# Altium schematic sheet Sheet2.SchDoc
size A4; SheetNumber: 2; SheetTotal: 5
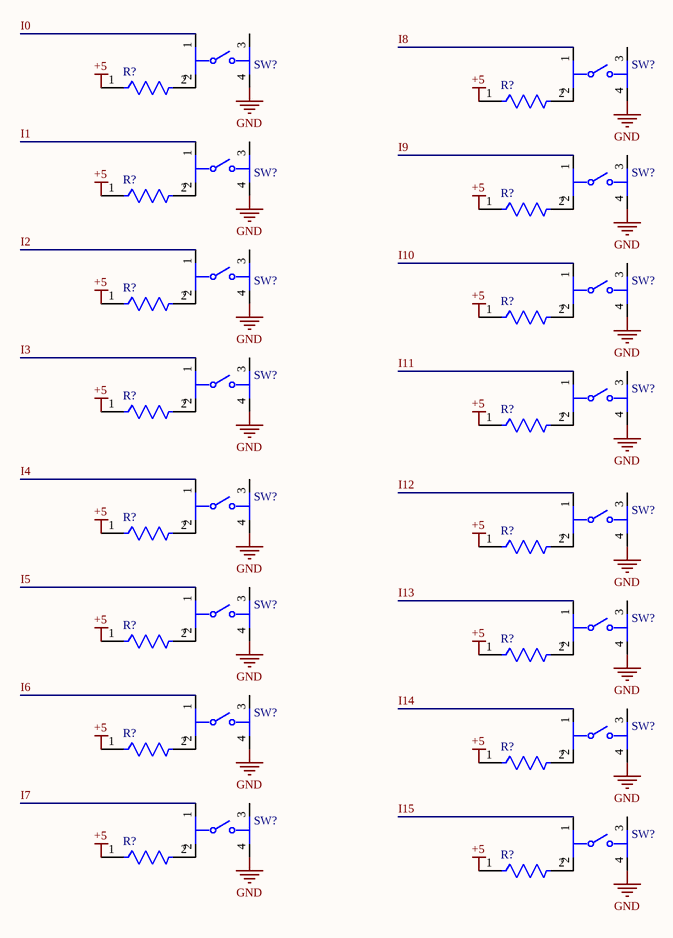
[diagram p0: Sheet2.SchDoc]

## Parts
(Parts that share a designator on the sheet are numbered #1, #2 ... from top to bottom, then left to right.)
R?#1  MRS25000C1001FCT00  [FP-MRS25-MFG]  (value not drawn)
R?#2  MRS25000C1001FCT00  [FP-MRS25-MFG]  (value not drawn)
R?#3  MRS25000C1001FCT00  [FP-MRS25-MFG]  (value not drawn)
R?#4  MRS25000C1001FCT00  [FP-MRS25-MFG]  (value not drawn)
R?#5  MRS25000C1001FCT00  [FP-MRS25-MFG]  (value not drawn)
R?#6  MRS25000C1001FCT00  [FP-MRS25-MFG]  (value not drawn)
R?#7  MRS25000C1001FCT00  [FP-MRS25-MFG]  (value not drawn)
R?#8  MRS25000C1001FCT00  [FP-MRS25-MFG]  (value not drawn)
R?#9  MRS25000C1001FCT00  [FP-MRS25-MFG]  (value not drawn)
R?#10  MRS25000C1001FCT00  [FP-MRS25-MFG]  (value not drawn)
R?#11  MRS25000C1001FCT00  [FP-MRS25-MFG]  (value not drawn)
R?#12  MRS25000C1001FCT00  [FP-MRS25-MFG]  (value not drawn)
R?#13  MRS25000C1001FCT00  [FP-MRS25-MFG]  (value not drawn)
R?#14  MRS25000C1001FCT00  [FP-MRS25-MFG]  (value not drawn)
R?#15  MRS25000C1001FCT00  [FP-MRS25-MFG]  (value not drawn)
R?#16  MRS25000C1001FCT00  [FP-MRS25-MFG]  (value not drawn)
SW?#1  1-1825910-5  [FP-1-1825910-5-MFG]  (value not drawn)
SW?#2  1-1825910-5  [FP-1-1825910-5-MFG]  (value not drawn)
SW?#3  1-1825910-5  [FP-1-1825910-5-MFG]  (value not drawn)
SW?#4  1-1825910-5  [FP-1-1825910-5-MFG]  (value not drawn)
SW?#5  1-1825910-5  [FP-1-1825910-5-MFG]  (value not drawn)
SW?#6  1-1825910-5  [FP-1-1825910-5-MFG]  (value not drawn)
SW?#7  1-1825910-5  [FP-1-1825910-5-MFG]  (value not drawn)
SW?#8  1-1825910-5  [FP-1-1825910-5-MFG]  (value not drawn)
SW?#9  1-1825910-5  [FP-1-1825910-5-MFG]  (value not drawn)
SW?#10  1-1825910-5  [FP-1-1825910-5-MFG]  (value not drawn)
SW?#11  1-1825910-5  [FP-1-1825910-5-MFG]  (value not drawn)
SW?#12  1-1825910-5  [FP-1-1825910-5-MFG]  (value not drawn)
SW?#13  1-1825910-5  [FP-1-1825910-5-MFG]  (value not drawn)
SW?#14  1-1825910-5  [FP-1-1825910-5-MFG]  (value not drawn)
SW?#15  1-1825910-5  [FP-1-1825910-5-MFG]  (value not drawn)
SW?#16  1-1825910-5  [FP-1-1825910-5-MFG]  (value not drawn)

## Nets
+5: R?#1.1 R?#2.1 R?#3.1 R?#4.1 R?#5.1 R?#6.1 R?#7.1 R?#8.1 R?#9.1 R?#10.1 R?#11.1 R?#12.1 R?#13.1 R?#14.1 R?#15.1 R?#16.1
GND: SW?#1.4 SW?#2.4 SW?#3.4 SW?#4.4 SW?#5.4 SW?#6.4 SW?#7.4 SW?#8.4 SW?#9.4 SW?#10.4 SW?#11.4 SW?#12.4 SW?#13.4 SW?#14.4 SW?#15.4 SW?#16.4
I0: SW?#1.1
I1: SW?#3.1
I2: SW?#5.1
I3: SW?#7.1
I4: SW?#9.1
I5: SW?#11.1
I6: SW?#13.1
I7: SW?#15.1
I8: SW?#2.1
I9: SW?#4.1
I10: SW?#6.1
I11: SW?#8.1
I12: SW?#10.1
I13: SW?#12.1
I14: SW?#14.1
I15: SW?#16.1
NetR?#1_2: R?#1.2 SW?#1.2
NetR?#2_2: R?#2.2 SW?#2.2
NetR?#3_2: R?#3.2 SW?#3.2
NetR?#4_2: R?#4.2 SW?#4.2
NetR?#5_2: R?#5.2 SW?#5.2
NetR?#6_2: R?#6.2 SW?#6.2
NetR?#7_2: R?#7.2 SW?#7.2
NetR?#8_2: R?#8.2 SW?#8.2
NetR?#9_2: R?#9.2 SW?#9.2
NetR?#10_2: R?#10.2 SW?#10.2
NetR?#11_2: R?#11.2 SW?#11.2
NetR?#12_2: R?#12.2 SW?#12.2
NetR?#13_2: R?#13.2 SW?#13.2
NetR?#14_2: R?#14.2 SW?#14.2
NetR?#15_2: R?#15.2 SW?#15.2
NetR?#16_2: R?#16.2 SW?#16.2

Not connected (* = marked no-connect by the designer): SW?#1 3; SW?#2 3; SW?#3 3; SW?#4 3; SW?#5 3; SW?#6 3; SW?#7 3; SW?#8 3; SW?#9 3; SW?#10 3; SW?#11 3; SW?#12 3; SW?#13 3; SW?#14 3; SW?#15 3; SW?#16 3

## Library data of the parts
R?#1-R?#16 = CMP-02408-000051-1: RES 1K OHM 0.6W 1% AXIAL; Power Rating: 600mW; Lead Diameter: 0.6mm; Voltage Rating (DC): 350V; Resistance: 1kR; Temperature Coefficient: 50ppm/°C; Width: 2.5mm; Military Standard: Not; Package Quantity: 5000; Radiation Hardening: No; Case/Package: Axial; Resistance Tolerance: 1%; Resistor Type: Metal Film; Contact Plating: Tin; Length: 6.5mm; Lead Free: Lead Free; RoHS Compliant: Yes; Mount: Through Hole; Number of Pins: 2; Technology: THIN FILM; Voltage Rating: 350V; Min Operating Temperature: -55°C; Weight: 0.00776oz; Diameter: 2.5mm; Construction: Cylindrical; Series: MRS25; Tolerance: 1%; Packaging: Tape and Reel; Max Operating Temperature: 155°C; Max Power Dissipation: 600mW; Number of Terminations: 2; Termination: Axial
SW?#1-SW?#16 = CMP-03407-000006-1: SWITCH TACTILE SPST-NO 0.05A 24V; Contact Current Rating: 50mA; Actuator Length: 5.9mm; Switch Travel: 0.25mm; Electrical Life: 100000Cycles; Operating Force: 2.55N; Actuator Color: Red; Switch Function: Off-Mom; Throw Configuration: SPST; Contact Resistance: 100mR; Actuator Material: PBT; Actuator Type: Standard; Illumination Type: Non-Illuminated; Package Quantity: 750; Contact Plating: Silver; Length: 5.99mm; Contact Material: Brass; Type: Switch; Max Operating Temperature: 85°C; Orientation: Straight; Mechanical Life: 100000Cycles; Max Voltage Rating (DC): 24V; Series: FSMJ, Alcoswitch; Max Current Rating: 50mA; Radiation Hardening: No; Min Operating Temperature: -35°C; RoHS Compliant: Yes; Mount: Through Hole; Voltage Rating (DC): 24V; Termination: PC Pins; Packaging: Loose Piece